# EasyEDA schematic SELE_async_v0.1.json
TITLE: SELE_Async; REV: 0.1; Date: 17.11.2019.; Sheet: 1/1; Drawn By: Dino
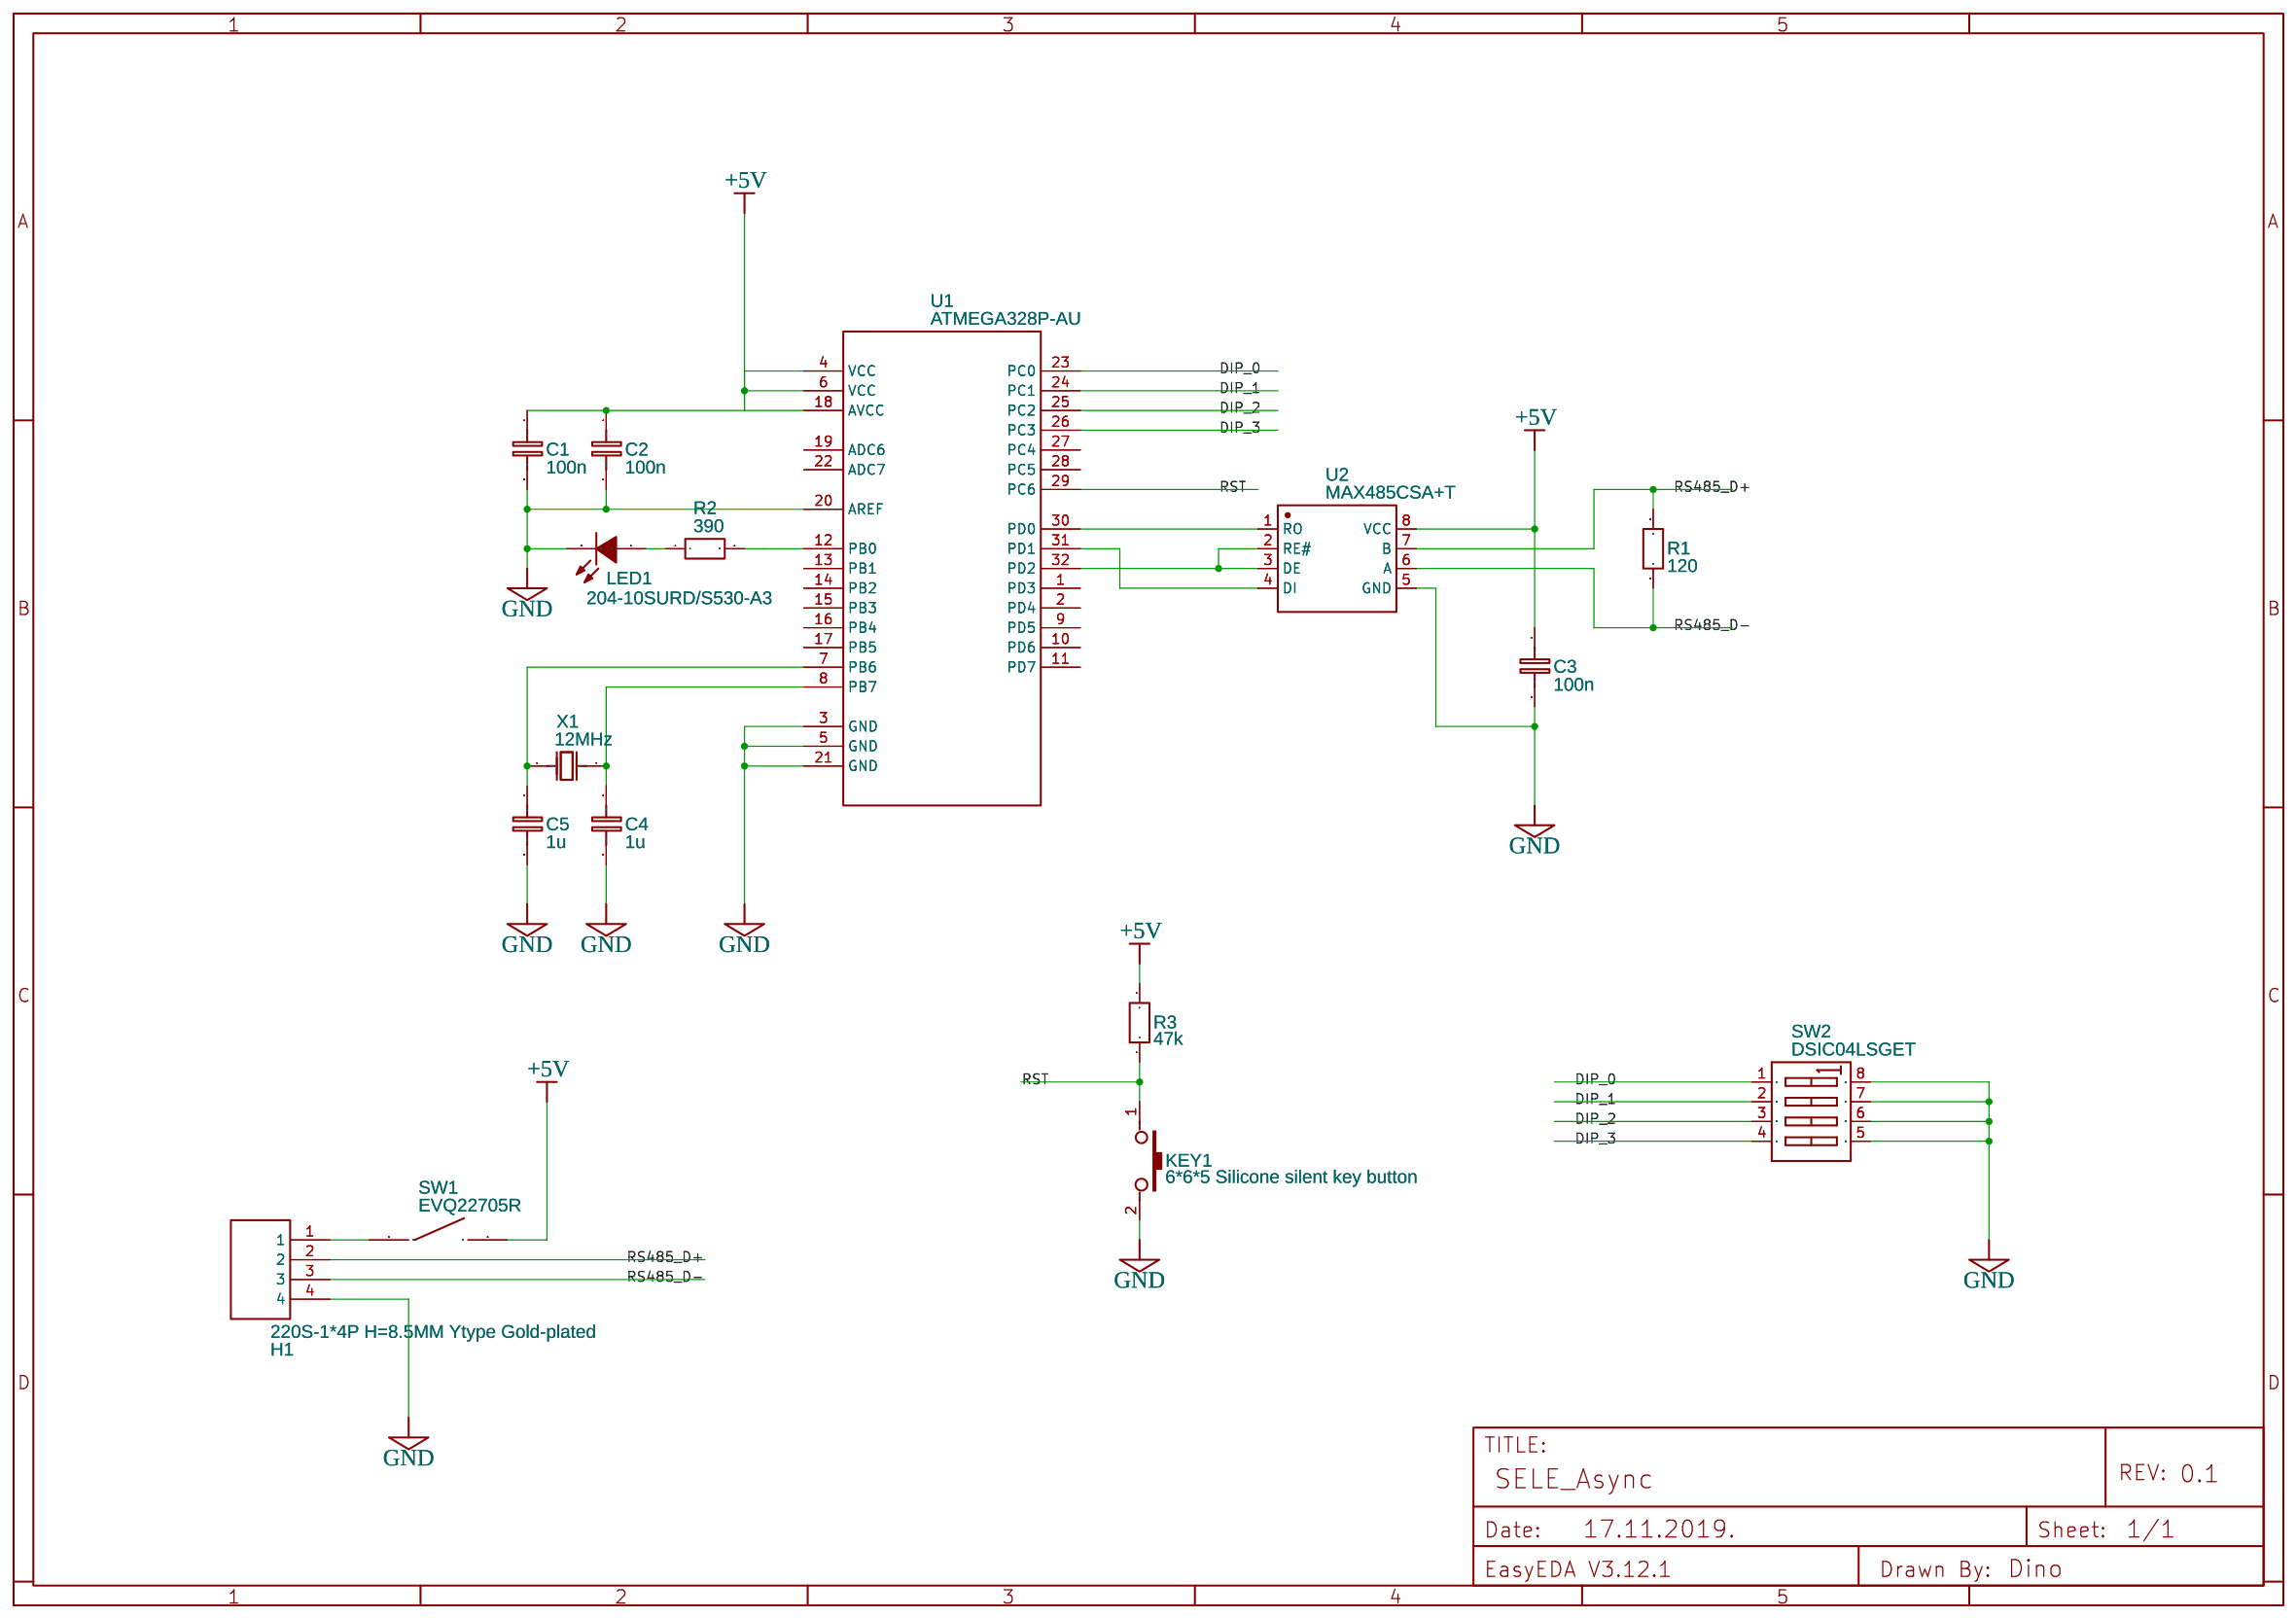
[diagram p0: schematic sheet]

## Parts
C1  100n  [0603]
C2  100n  [0603]
C3  100n  [0603]
C4  1u  [0603]
C5  1u  [0603]
H1  220S-1*4P H=8.5MM Ytype Gold-plated  [DIP-1X4P2.54]
KEY1  6*6*5 Silicone silent key button  [KEY-SMD_2P-L6.0-W6.0-P6.00]
LED1  204-10SURD/S530-A3  [LED-3MM/2.54]
R1  120  [0603]
R2  390  [0603]
R3  47k  [0603]
SW1  EVQ22705R  [KEY-6.0*6.0-4]
SW2  DSIC04LSGET  [SWITCH-KE-4BIT/2.54_SMD]
U1  ATMEGA328P-AU  [TQFP-32_L7.0-W7.0-P0.80-LS9.0-TL]
U2  MAX485CSA+T  [SOIC-8_150MIL]
X1  12MHz  [HC-49US_L11.5-W4.5-P4.88]

## Library data of the parts
C1-C5 = Cap_0603_EU
H1 = -: Supplier: LCSC; Manufacturer: Ckmtw; Contributor: LCSC; Supplier Part: C124413
KEY1 = -: Supplier Part: C61120; Supplier: LCSC; Manufacturer: ReliaPro
LED1 = -: Supplier: LCSC; Manufacturer: EVERLIGHT; Supplier Part: C99772
R1-R3 = Res_0603(1/10W)_EU
SW1 = -: Supplier: LCSC; Manufacturer: PANASONIC; Contributor: LCSC; Supplier Part: C79156
SW2 = -: Supplier: LCSC; Manufacturer: KE; image: //image.lceda.cn/szlcsc/C54950.jpg; Supplier Part: C54950
U1 = -: Supplier: LCSC; Manufacturer: MICROCHIP; image: //image.lceda.cn/szlcsc/C14877.jpg; Supplier Part: C14877; LCSC Assembly: Yes; SMT Type: Extend
U2 = -: Supplier: LCSC; Manufacturer: MAXIM; image: //image.lceda.cn/szlcsc/C9945.jpg; Supplier Part: C9945; LCSC Assembly: Yes; SMT Type: Extend
X1 = X49SD12MSD2SC: Supplier: LCSC; Manufacturer: YXC; Supplier Part: C16369

## Nets
+5V: C1.1 C2.1 C3.1 R3.2 SW1.2 U1.4(VCC) U1.6(VCC) U1.18(AVCC) U2.8(VCC)
GND: C1.2 C2.2 C3.2 C4.2 C5.2 H1.4 KEY1.2 LED1.2(K) SW2.5(B4) SW2.6(B3) SW2.7(B2) SW2.8(B1) U1.3(GND) U1.5(GND) U1.20(AREF) U1.21(GND) U2.5(GND)
DIP_0: SW2.1(A1) U1.23(PC0)
DIP_1: SW2.2(A2) U1.24(PC1)
DIP_2: SW2.3(A3) U1.25(PC2)
DIP_3: SW2.4(A4) U1.26(PC3)
RS485_D+: H1.2 R1.2 U2.7(B)
RS485_D-: H1.3 R1.1 U2.6(A)
RST: KEY1.1 R3.1 U1.29(PC6)
Net-(C4-1): C4.1 U1.8(PB7) X1.1(OSC1)
Net-(C5-1): C5.1 U1.7(PB6) X1.2(OSC2)
Net-(H1-1): H1.1 SW1.1
Net-(LED1-1): LED1.1(A) R2.1
Net-(R2-2): R2.2 U1.12(PB0)
Net-(U1-30): U1.30(PD0) U2.1(RO)
Net-(U1-31): U1.31(PD1) U2.4(DI)
Net-(U1-32): U1.32(PD2) U2.2(RE#) U2.3(DE)

Not connected (* = marked no-connect by the designer): U1 1(PD3) 2(PD4) 9(PD5) 10(PD6) 11(PD7) 13(PB1) 14(PB2) 15(PB3) 16(PB4) 17(PB5) 19(ADC6) 22(ADC7) 27(PC4) 28(PC5)
